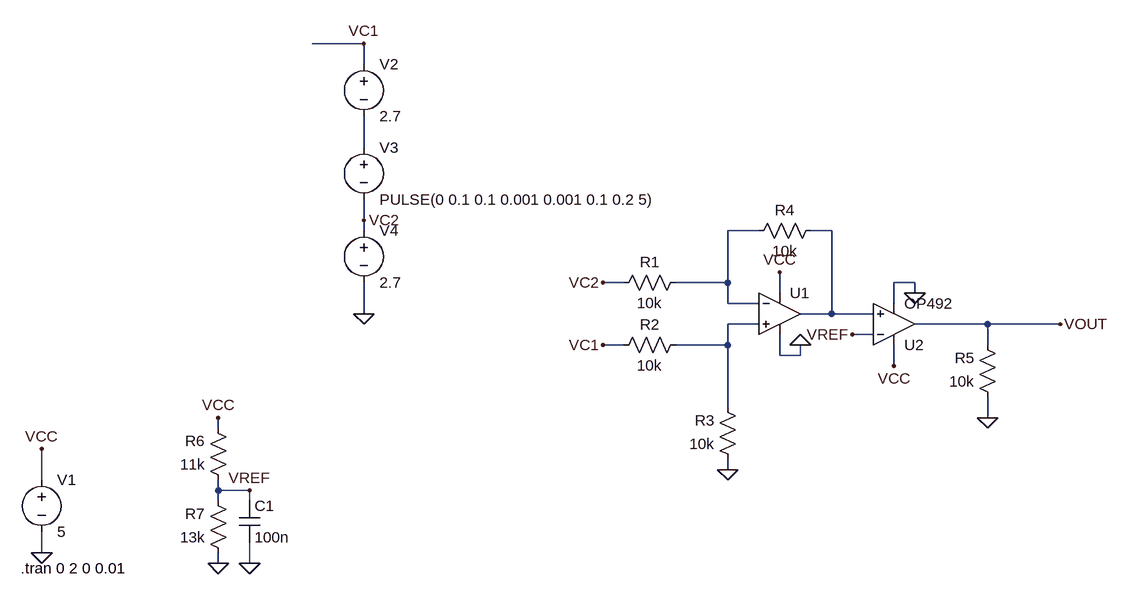
[diagram p0: schematic Draft7.asc]
Draft7.asc, the LTspice schematic file:
Version 4.1
SHEET 1 1192 680
WIRE -384 -288 -464 -288
WIRE -384 -256 -384 -288
WIRE -384 -128 -384 -176
WIRE -384 -16 -384 -48
WIRE -384 0 -384 -16
WIRE 224 0 176 0
WIRE 336 0 304 0
WIRE 16 80 -16 80
WIRE 176 80 176 0
WIRE 176 80 96 80
WIRE 464 80 432 80
WIRE 256 96 256 64
WIRE 464 96 464 80
WIRE 176 112 176 80
WIRE 224 112 176 112
WIRE 432 112 432 80
WIRE -384 128 -384 80
WIRE 336 128 336 0
WIRE 336 128 288 128
WIRE 400 128 336 128
WIRE 224 144 176 144
WIRE 576 144 464 144
WIRE 688 144 576 144
WIRE 400 160 368 160
WIRE 16 176 -16 176
WIRE 176 176 176 144
WIRE 176 176 96 176
WIRE 576 176 576 144
WIRE 256 192 256 160
WIRE 288 192 288 176
WIRE 288 192 256 192
WIRE 432 208 432 176
WIRE 176 272 176 176
WIRE 576 288 576 256
WIRE -608 304 -608 288
WIRE 176 368 176 352
WIRE -880 384 -880 336
WIRE -608 400 -608 384
WIRE -560 400 -608 400
WIRE -608 416 -608 400
WIRE -560 416 -560 400
WIRE -880 496 -880 464
WIRE -608 512 -608 496
WIRE -560 512 -560 480
FLAG -880 496 0
FLAG -880 336 VCC
FLAG -384 128 0
FLAG -384 -288 VC1
FLAG -384 -16 VC2
FLAG -16 80 VC2
FLAG 288 176 0
FLAG 256 64 VCC
FLAG 176 368 0
FLAG 464 96 0
FLAG 432 208 VCC
FLAG 688 144 VOUT
FLAG -16 176 VC1
FLAG 576 288 0
FLAG -608 512 0
FLAG -608 288 VCC
FLAG -560 512 0
FLAG -560 400 VREF
FLAG 368 160 VREF
SYMBOL res 112 64 R90
WINDOW 0 0 56 VBottom 2
WINDOW 3 32 56 VTop 2
SYMATTR InstName R1
SYMATTR Value 10k
SYMBOL res 112 160 R90
WINDOW 0 0 56 VBottom 2
WINDOW 3 32 56 VTop 2
SYMATTR InstName R2
SYMATTR Value 10k
SYMBOL res 192 368 R180
WINDOW 0 36 76 Left 2
WINDOW 3 36 40 Left 2
SYMATTR InstName R3
SYMATTR Value 10k
SYMBOL res 208 16 R270
WINDOW 0 32 56 VTop 2
WINDOW 3 0 56 VBottom 2
SYMATTR InstName R4
SYMATTR Value 10k
SYMBOL OpAmps\\UniversalOpAmp 256 128 R0
SYMATTR InstName U1
SYMBOL voltage -880 368 R0
WINDOW 123 0 0 Left 0
WINDOW 39 0 0 Left 0
SYMATTR InstName V1
SYMATTR Value 5
SYMBOL voltage -384 -272 R0
WINDOW 123 0 0 Left 0
WINDOW 39 0 0 Left 0
SYMATTR InstName V2
SYMATTR Value 2.7
SYMBOL voltage -384 -144 R0
WINDOW 123 0 0 Left 0
WINDOW 39 0 0 Left 0
SYMATTR InstName V3
SYMATTR Value PULSE(0 0.1 0.1 0.001 0.001 0.1 0.2 5)
SYMBOL voltage -384 -16 R0
WINDOW 123 0 0 Left 0
WINDOW 39 0 0 Left 0
SYMATTR InstName V4
SYMATTR Value 2.7
SYMBOL res 592 272 R180
WINDOW 0 36 76 Left 2
WINDOW 3 36 40 Left 2
SYMATTR InstName R5
SYMATTR Value 10k
SYMBOL OpAmps\\OP492 432 208 M180
SYMATTR InstName U2
SYMBOL res -592 400 R180
WINDOW 0 36 76 Left 2
WINDOW 3 36 40 Left 2
SYMATTR InstName R6
SYMATTR Value 11k
SYMBOL res -592 512 R180
WINDOW 0 36 76 Left 2
WINDOW 3 36 40 Left 2
SYMATTR InstName R7
SYMATTR Value 13k
SYMBOL cap -576 416 R0
SYMATTR InstName C1
SYMATTR Value 100n
TEXT -912 520 Left 2 !.tran 0 2 0 0.01

The netlist it stands for:
* Draft7.asc
R1 N002 VC2 10k
R2 N004 VC1 10k
R3 0 N004 10k
R4 N002 N003 10k
X§U1 N004 N002 VCC 0 N003 level1 Avol=1Meg GBW=10Meg Vos=0 En=0 Enk=0 In=0 Ink=0 Rin=500Meg  ; pins In+ In- V+ V- OUT
V1 VCC 0 5
V2 VC1 N001 2.7
V3 N001 VC2 PULSE(0 0.1 0.1 0.001 0.001 0.1 0.2 5)
V4 VC2 0 2.7
R5 0 VOUT 10k
X§U2 N003 VREF VCC 0 VOUT OP492  ; pins In+ In- V+ V- OUT
R6 VREF VCC 11k
R7 0 VREF 13k
C1 VREF 0 100n
.tran 0 2 0 0.01
.lib UniversalOpAmp1.lib
.backanno
.end